# Altium schematic sheet PROCESSOR.SchDoc: Pin Swapping
size 558 x 431 mm; DocumentNumber: 2; SheetNumber: 2; SheetTotal: 6
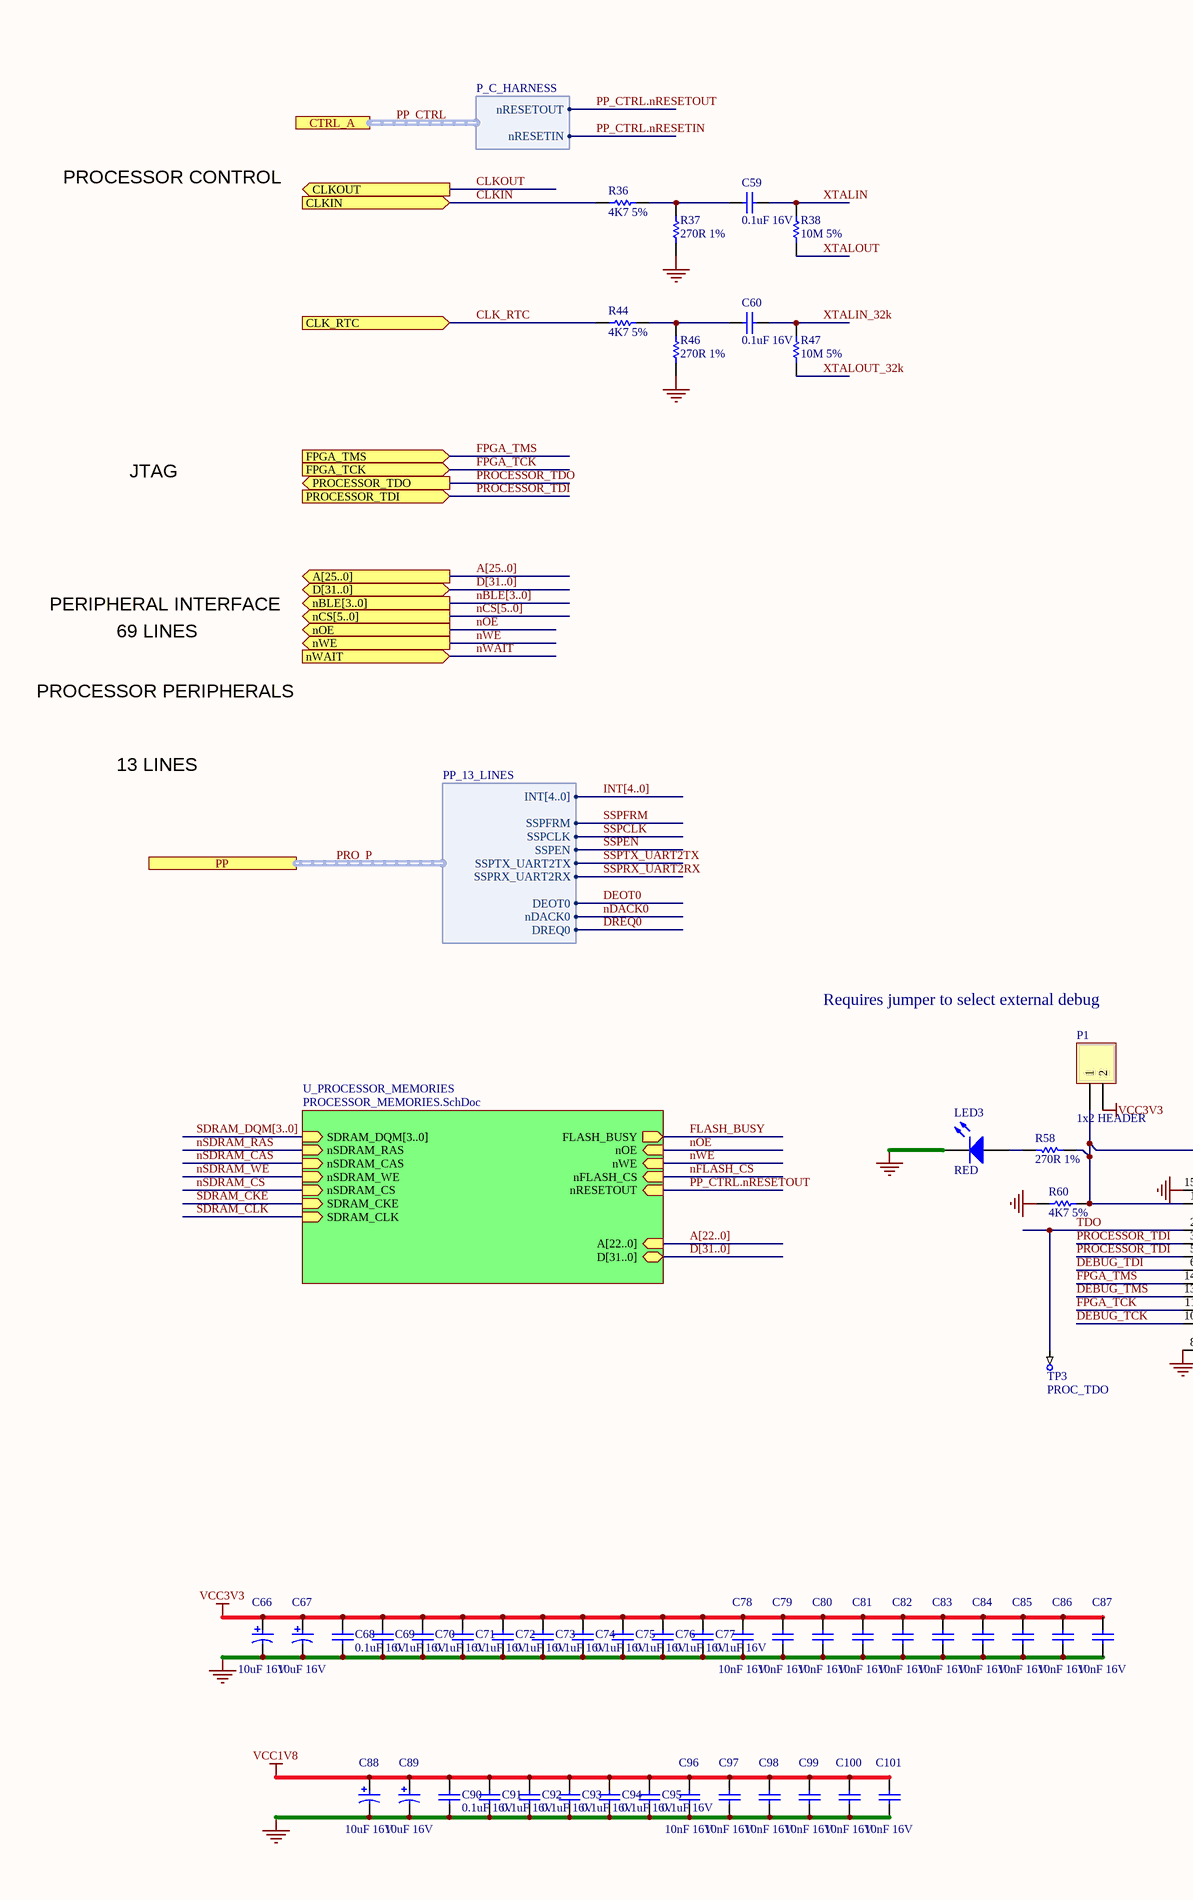
[diagram p0: PROCESSOR.SchDoc, left]
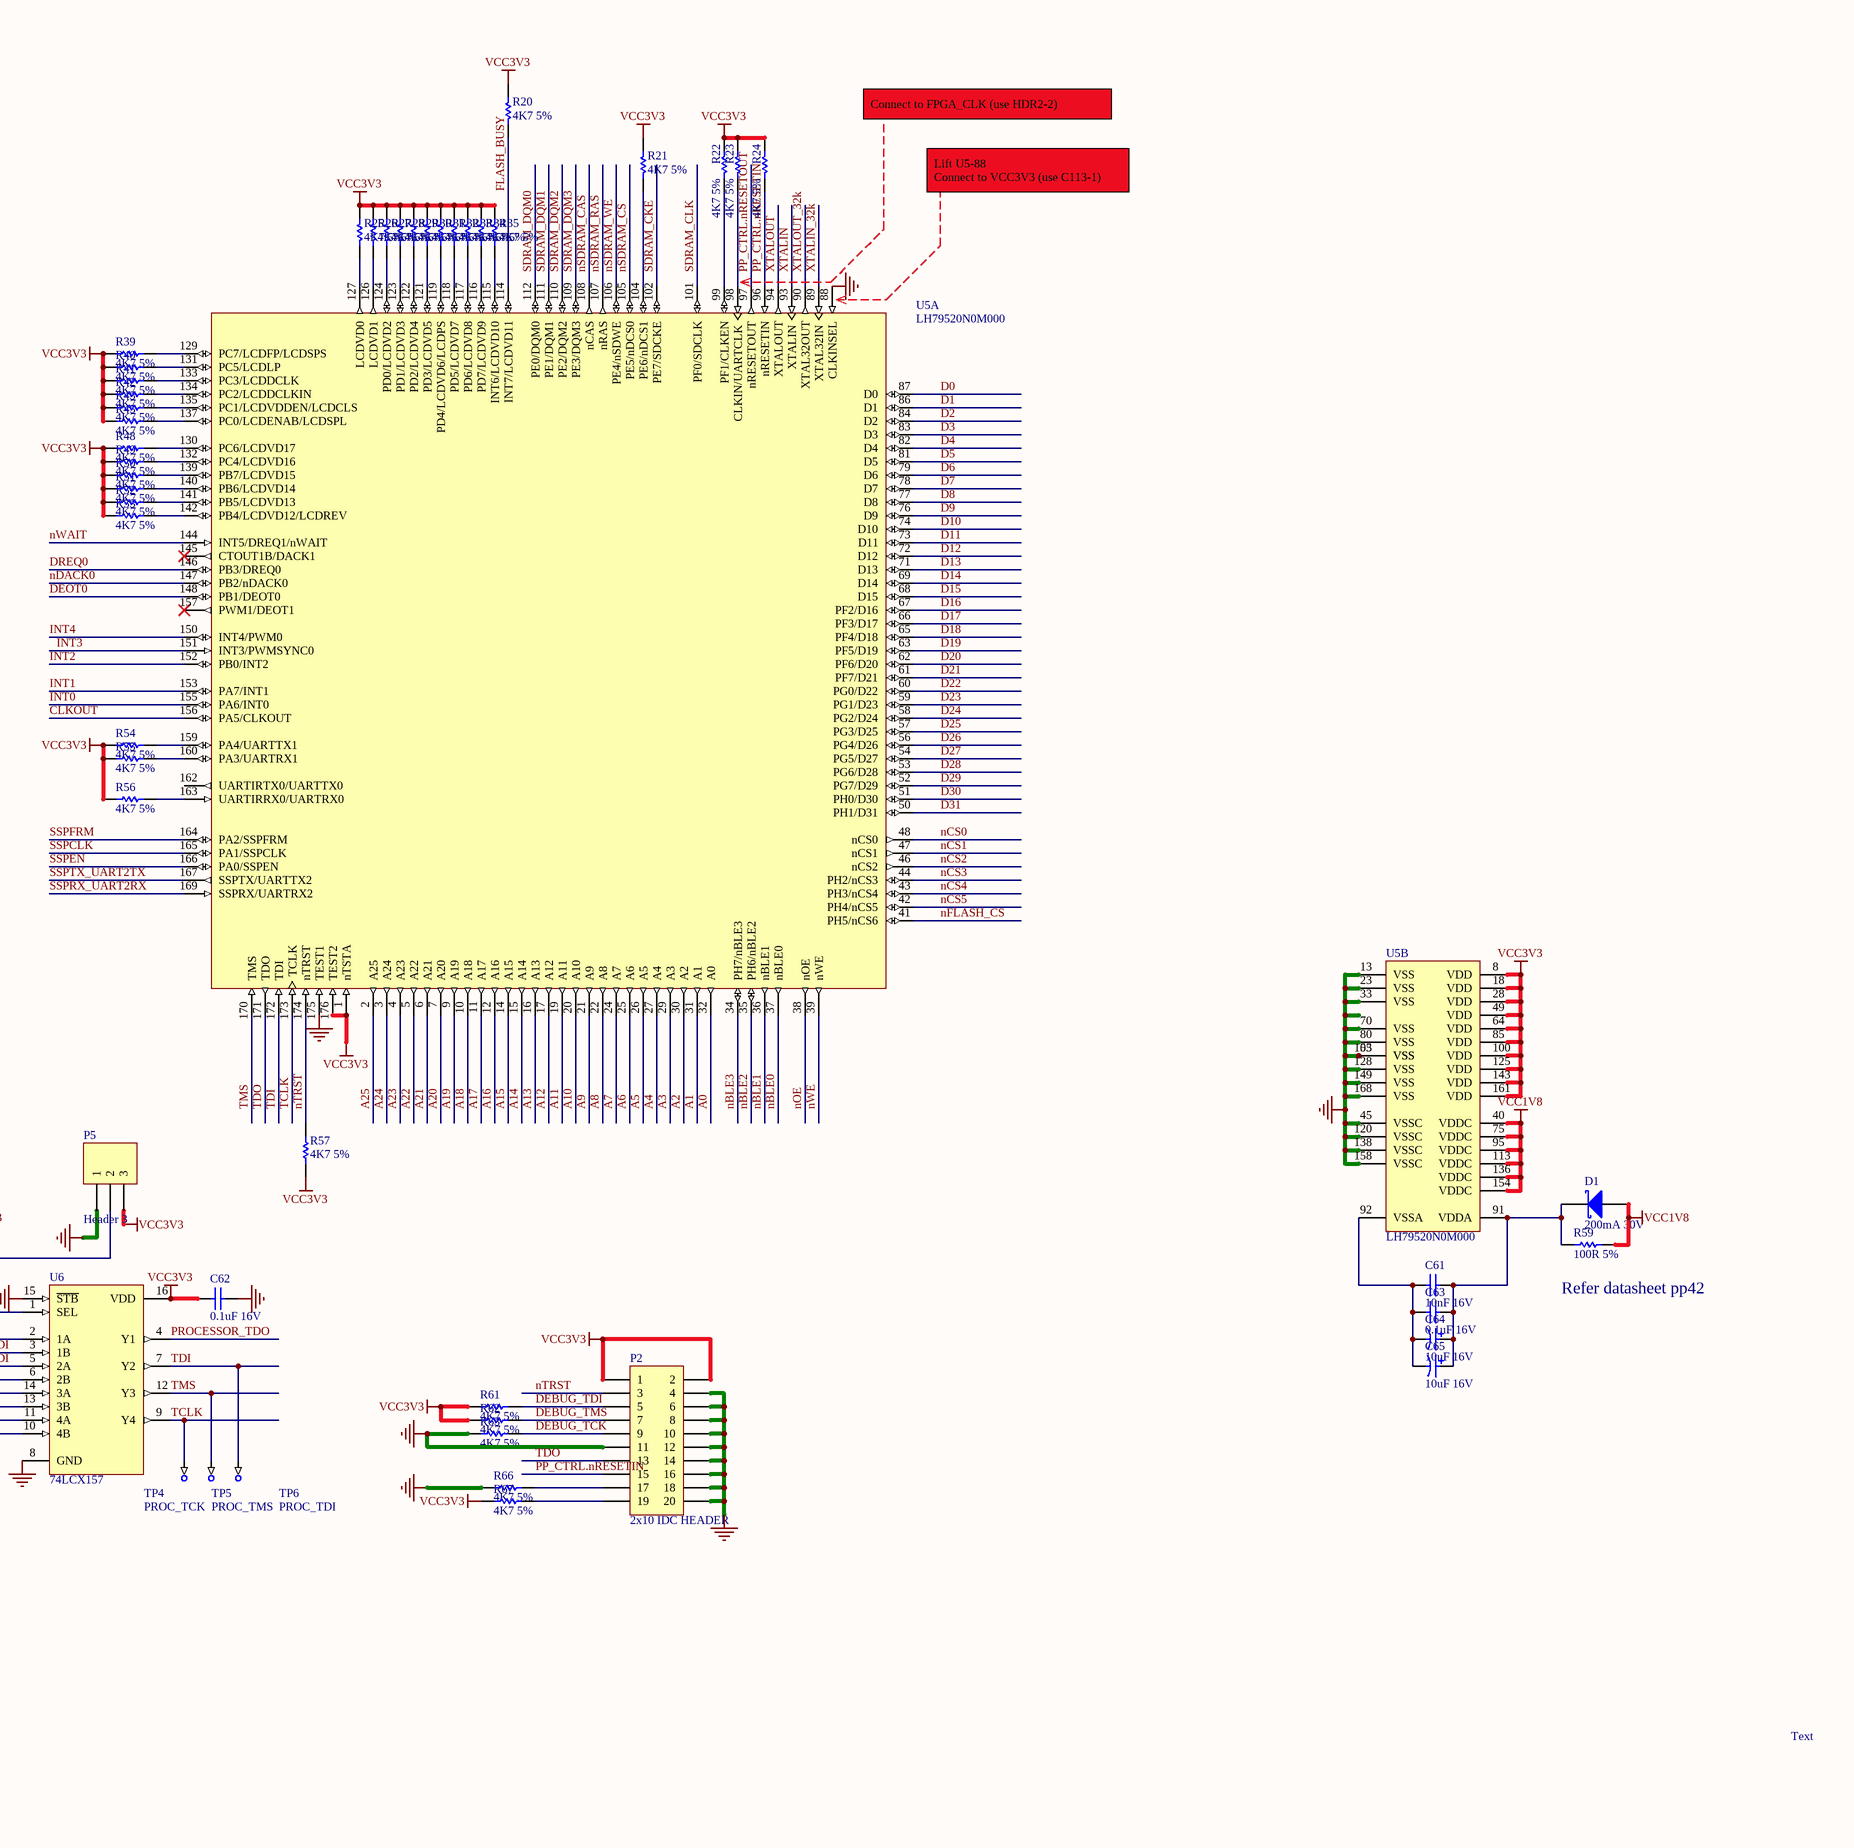
[diagram p1: PROCESSOR.SchDoc, right]

## Parts
C59  0.1uF 16V  [CAPC1005]
C60  0.1uF 16V  [CAPC1005]
C61  10nF 16V  [CAPC1005]
C62  0.1uF 16V  [CAPC1005]
C63  0.1uF 16V  [CAPC1005]
C64  10uF 16V  [CAPC3528]
C65  10uF 16V  [CAPC3528]
C66  10uF 16V  [CAPC3528]
C67  10uF 16V  [CAPC3528]
C68  0.1uF 16V  [CAPC1005]
C69  0.1uF 16V  [CAPC1005]
C70  0.1uF 16V  [CAPC1005]
C71  0.1uF 16V  [CAPC1005]
C72  0.1uF 16V  [CAPC1005]
C73  0.1uF 16V  [CAPC1005]
C74  0.1uF 16V  [CAPC1005]
C75  0.1uF 16V  [CAPC1005]
C76  0.1uF 16V  [CAPC1005]
C77  0.1uF 16V  [CAPC1005]
C78  10nF 16V  [CAPC1005]
C79  10nF 16V  [CAPC1005]
C80  10nF 16V  [CAPC1005]
C81  10nF 16V  [CAPC1005]
C82  10nF 16V  [CAPC1005]
C83  10nF 16V  [CAPC1005]
C84  10nF 16V  [CAPC1005]
C85  10nF 16V  [CAPC1005]
C86  10nF 16V  [CAPC1005]
C87  10nF 16V  [CAPC1005]
C88  10uF 16V  [CAPC3528]
C89  10uF 16V  [CAPC3528]
C90  0.1uF 16V  [CAPC1005]
C91  0.1uF 16V  [CAPC1005]
C92  0.1uF 16V  [CAPC1005]
C93  0.1uF 16V  [CAPC1005]
C94  0.1uF 16V  [CAPC1005]
C95  0.1uF 16V  [CAPC1005]
C96  10nF 16V  [CAPC1005]
C97  10nF 16V  [CAPC1005]
C98  10nF 16V  [CAPC1005]
C99  10nF 16V  [CAPC1005]
C100  10nF 16V  [CAPC1005]
C101  10nF 16V  [CAPC1005]
D1  200mA 30V  [SOT95P230-3]
LED3  RED  [LED2013]
P1  1x2 HEADER  [HDR1X2]
P2  2x10 IDC HEADER  [IDC2.54-V20D]
P5  Header 3  [HDR1X3]
R20  4K7 5%  [RESC1005]
R21  4K7 5%  [RESC1005]
R22  4K7 5%  [RESC1005]
R23  4K7 5%  [RESC1005]
R24  4K7 5%  [RESC1005]
R25  4K7 5%  [RESC1005]
R26  4K7 5%  [RESC1005]
R27  4K7 5%  [RESC1005]
R28  4K7 5%  [RESC1005]
R29  4K7 5%  [RESC1005]
R30  4K7 5%  [RESC1005]
R31  4K7 5%  [RESC1005]
R32  4K7 5%  [RESC1005]
R33  4K7 5%  [RESC1005]
R34  4K7 5%  [RESC1005]
R35  4K7 5%  [RESC1005]
R36  4K7 5%  [RESC1005]
R37  270R 1%  [RESC2012]
R38  10M 5%  [RESC2012]
R39  4K7 5%  [RESC1005]
R40  4K7 5%  [RESC1005]
R41  4K7 5%  [RESC1005]
R42  4K7 5%  [RESC1005]
R43  4K7 5%  [RESC1005]
R44  4K7 5%  [RESC1005]
R45  4K7 5%  [RESC1005]
R46  270R 1%  [RESC2012]
R47  10M 5%  [RESC2012]
R48  4K7 5%  [RESC1005]
R49  4K7 5%  [RESC1005]
R50  4K7 5%  [RESC1005]
R51  4K7 5%  [RESC1005]
R52  4K7 5%  [RESC1005]
R53  4K7 5%  [RESC1005]
R54  4K7 5%  [RESC1005]
R55  4K7 5%  [RESC1005]
R56  4K7 5%  [RESC1005]
R57  4K7 5%  [RESC1005]
R58  270R 1%  [RESC2012]
R59  100R 5%  [RESC2012]
R60  4K7 5%  [RESC1005]
R61  4K7 5%  [RESC1005]
R62  4K7 5%  [RESC1005]
R63  4K7 5%  [RESC1005]
R66  4K7 5%  [RESC1005]
R67  4K7 5%  [RESC1005]
TP3  PROC_TDO  [TestPin]  (no BOM)
TP4  PROC_TCK  [TestPin]  (no BOM)
TP5  PROC_TMS  [TestPin]  (no BOM)
TP6  PROC_TDI  [TestPin]  (no BOM)
U5  LH79520N0M000  [QFP40P2000X2000-176]  (parts A,B of 2)
U6  74LCX157  [TSOP65P638-16]

## Sub-sheets
U_PROCESSOR_MEMORIES = PROCESSOR_MEMORIES.SchDoc: SDRAM_DQM[3..0] (in), nSDRAM_RAS (in), nSDRAM_CAS (in), nSDRAM_WE (in), nSDRAM_CS (in), SDRAM_CKE (in), SDRAM_CLK (in), A[22..0] (in), D[31..0] (bidir), nOE (in), nWE (in), nFLASH_CS (in), nRESETOUT (in), FLASH_BUSY (out)

## Ports
A[25..0] (out), CLK_RTC (in), CLKIN (in), CLKOUT (out), CTRL_A (harness P_C_HARNESS), D[31..0] (bidir), FPGA_TCK (in), FPGA_TMS (in), nBLE[3..0] (out), nCS[5..0] (out), nOE (out), nWAIT (in), nWE (out), PP (harness PP_13_LINES), PROCESSOR_TDI (in), PROCESSOR_TDO (out)

## Harnesses
PP_13_LINES: INT[4..0], SSPFRM, SSPCLK, SSPEN, SSPTX_UART2TX, SSPRX_UART2RX, DEOT0, nDACK0, DREQ0
P_C_HARNESS: nRESETOUT, nRESETIN

## Nets
GND: C62.2 C66.2 C67.2 C68.2 C69.2 C70.2 C71.2 C72.2 C73.2 C74.2 C75.2 C76.2 C77.2 C78.2 C79.2 C80.2 C81.2 C82.2 C83.2 C84.2 C85.2 C86.2 C87.2 C88.2 C89.2 C90.2 C91.2 C92.2 C93.2 C94.2 C95.2 C96.2 C97.2 C98.2 C99.2 C100.2 C101.2 LED3.2(K) P2.4 P2.6 P2.8 P2.10 P2.11 P2.12 P2.14 P2.16 P2.18 P2.20 P5.1 R37.1 R46.1 R60.2 R63.1 R66.1 U5.13(VSS) U5.23(VSS) U5.33(VSS) U5.45(VSSC) U5.55(VSS) U5.70(VSS) U5.80(VSS) U5.88(CLKINSEL) U5.103(VSS) U5.120(VSSC) U5.128(VSS) U5.138(VSSC) U5.149(VSS) U5.158(VSSC) U5.168(VSS) U5.175(TEST1) U6.8(GND) U6.15(~{STB})
VCC1V8: C88.1 C89.1 C90.1 C91.1 C92.1 C93.1 C94.1 C95.1 C96.1 C97.1 C98.1 C99.1 C100.1 C101.1 D1.1(A) R59.1 U5.40(VDDC) U5.75(VDDC) U5.95(VDDC) U5.113(VDDC) U5.136(VDDC) U5.154(VDDC)
VCC3V3: C62.1 C66.1 C67.1 C68.1 C69.1 C70.1 C71.1 C72.1 C73.1 C74.1 C75.1 C76.1 C77.1 C78.1 C79.1 C80.1 C81.1 C82.1 C83.1 C84.1 C85.1 C86.1 C87.1 P1.2 P2.1 P2.2 P5.3 R20.2 R21.2 R22.2 R23.2 R24.2 R25.2 R26.2 R27.2 R28.2 R29.2 R30.2 R31.2 R32.2 R33.2 R34.2 R35.2 R39.2 R40.2 R41.2 R42.2 R43.2 R45.2 R48.2 R49.2 R50.2 R51.2 R52.2 R53.2 R54.2 R55.2 R56.2 R57.2 R61.1 R62.1 R67.1 U5.1(nTSTA) U5.8(VDD) U5.18(VDD) U5.28(VDD) U5.49(VDD) U5.64(VDD) U5.85(VDD) U5.100(VDD) U5.125(VDD) U5.143(VDD) U5.161(VDD) U5.176(TEST2) U6.16(VDD)
A0: U5.32(A0)
A1: U5.31(A1)
A2: U5.30(A2)
A3: U5.29(A3)
A4: U5.27(A4)
A5: U5.26(A5)
A6: U5.25(A6)
A7: U5.24(A7)
A8: U5.22(A8)
A9: U5.21(A9)
A10: U5.20(A10)
A11: U5.19(A11)
A12: U5.17(A12)
A13: U5.16(A13)
A14: U5.15(A14)
A15: U5.14(A15)
A16: U5.12(A16)
A17: U5.11(A17)
A18: U5.10(A18)
A19: U5.9(A19)
A20: U5.7(A20)
A21: U5.6(A21)
A22: U5.5(A22)
A23: U5.4(A23)
A24: U5.3(A24)
A25: U5.2(A25)
CLK_RTC: R44.2 ; port CLK_RTC
CLKIN: R36.2 ; port CLKIN
CLKOUT: U5.156(PA5/CLKOUT) ; port CLKOUT
D0: U5.87(D0)
D1: U5.86(D1)
D2: U5.84(D2)
D3: U5.83(D3)
D4: U5.82(D4)
D5: U5.81(D5)
D6: U5.79(D6)
D7: U5.78(D7)
D8: U5.77(D8)
D9: U5.76(D9)
D10: U5.74(D10)
D11: U5.73(D11)
D12: U5.72(D12)
D13: U5.71(D13)
D14: U5.69(D14)
D15: U5.68(D15)
D16: U5.67(PF2/D16)
D17: U5.66(PF3/D17)
D18: U5.65(PF4/D18)
D19: U5.63(PF5/D19)
D20: U5.62(PF6/D20)
D21: U5.61(PF7/D21)
D22: U5.60(PG0/D22)
D23: U5.59(PG1/D23)
D24: U5.58(PG2/D24)
D25: U5.57(PG3/D25)
D26: U5.56(PG4/D26)
D27: U5.54(PG5/D27)
D28: U5.53(PG6/D28)
D29: U5.52(PG7/D29)
D30: U5.51(PH0/D30)
D31: U5.50(PH1/D31)
DEBUG_TCK: P2.9 R63.2 U6.10(4B)
DEBUG_TDI: P2.5 R61.2 U6.6(2B)
DEBUG_TMS: P2.7 R62.2 U6.13(3B)
DEOT0: U5.148(PB1/DEOT0) ; port PP.DEOT0
DREQ0: U5.146(PB3/DREQ0) ; port PP.DREQ0
FLASH_BUSY: R20.1 U5.114(INT7/LCDVD11) ; sheet U_PROCESSOR_MEMORIES/FLASH_BUSY
FPGA_TCK: U6.11(4A) ; port FPGA_TCK
FPGA_TMS: U6.14(3A) ; port FPGA_TMS
INT0: U5.155(PA6/INT0)
INT1: U5.153(PA7/INT1)
INT2: U5.152(PB0/INT2)
INT3: U5.151(INT3/PWMSYNC0)
INT4: U5.150(INT4/PWM0)
nBLE0: U5.37(nBLE0)
nBLE1: U5.36(nBLE1)
nBLE2: U5.35(PH6/nBLE2)
nBLE3: U5.34(PH7/nBLE3)
nCS0: U5.48(nCS0)
nCS1: U5.47(nCS1)
nCS2: U5.46(nCS2)
nCS3: U5.44(PH2/nCS3)
nCS4: U5.43(PH3/nCS4)
nCS5: U5.42(PH4/nCS5)
nDACK0: U5.147(PB2/nDACK0) ; port PP.nDACK0
nFLASH_CS: U5.41(PH5/nCS6) ; sheet U_PROCESSOR_MEMORIES/nFLASH_CS
nOE: U5.38(nOE) ; port nOE, sheet U_PROCESSOR_MEMORIES/nOE
nSDRAM_CAS: U5.108(nCAS) ; sheet U_PROCESSOR_MEMORIES/nSDRAM_CAS
nSDRAM_CS: U5.105(PE5/nDCS0) ; sheet U_PROCESSOR_MEMORIES/nSDRAM_CS
nSDRAM_RAS: U5.107(nRAS) ; sheet U_PROCESSOR_MEMORIES/nSDRAM_RAS
nSDRAM_WE: U5.106(PE4/nSDWE) ; sheet U_PROCESSOR_MEMORIES/nSDRAM_WE
nTRST: P2.3 R57.1 U5.174(nTRST)
nWAIT: U5.144(INT5/DREQ1/nWAIT) ; port nWAIT
nWE: U5.39(nWE) ; port nWE, sheet U_PROCESSOR_MEMORIES/nWE
PP_CTRL.nRESETIN: P2.15 R24.1 U5.96(nRESETIN) ; port CTRL_A.nRESETIN
PP_CTRL.nRESETOUT: U5.97(nRESETOUT) ; sheet U_PROCESSOR_MEMORIES/nRESETOUT, port CTRL_A.nRESETOUT
PROCESSOR_TDI: U6.3(1B) U6.5(2A) ; port PROCESSOR_TDI
PROCESSOR_TDO: U6.4(Y1) ; port PROCESSOR_TDO
SDRAM_CKE: U5.102(PE7/SDCKE) ; sheet U_PROCESSOR_MEMORIES/SDRAM_CKE
SDRAM_CLK: U5.101(PF0/SDCLK) ; sheet U_PROCESSOR_MEMORIES/SDRAM_CLK
SDRAM_DQM0: U5.112(PE0/DQM0)
SDRAM_DQM1: U5.111(PE1/DQM1)
SDRAM_DQM2: U5.110(PE2/DQM2)
SDRAM_DQM3: U5.109(PE3/DQM3)
SSPCLK: U5.165(PA1/SSPCLK) ; port PP.SSPCLK  [project net PRO_P.SSPCLK]
SSPEN: U5.166(PA0/SSPEN) ; port PP.SSPEN  [project net PRO_P.SSPEN]
SSPFRM: U5.164(PA2/SSPFRM) ; port PP.SSPFRM  [project net PRO_P.SSPFRM]
SSPRX_UART2RX: U5.169(SSPRX/UARTRX2) ; port PP.SSPRX_UART2RX  [project net PRO_P.SSPRX_UART2RX]
SSPTX_UART2TX: U5.167(SSPTX/UARTTX2) ; port PP.SSPTX_UART2TX  [project net PRO_P.SSPTX_UART2TX]
TCLK: TP4.1 U5.173(TCLK) U6.9(Y4)
TDI: TP6.1 U5.172(TDI) U6.7(Y2)
TDO: P2.13 TP3.1 U5.171(TDO) U6.2(1A)
TMS: TP5.1 U5.170(TMS) U6.12(Y3)
XTALIN: C59.2 R38.1 U5.93(XTALIN)
XTALIN_32k: C60.2 R47.1 U5.89(XTAL32IN)
XTALOUT: R38.2 U5.94(XTALOUT)
XTALOUT_32k: R47.2 U5.90(XTAL32OUT)
NetC59_1: C59.1 R36.1 R37.2
NetC60_1: C60.1 R44.1 R46.2
NetC61_1: C61.1 C63.1 C64.1 C65.1 D1.3(k) R59.2 U5.91(VDDA)
NetC61_2: C61.2 C63.2 C64.2 C65.2 U5.92(VSSA)
NetLED3_1: LED3.1(A) R58.2
NetP1_1: P1.1 P5.2 R58.1 R60.1 U6.1(SEL)
NetP2_17: P2.17 R66.2
NetP2_19: P2.19 R67.2
NetR21_1: R21.1 U5.104(PE6/nDCS1)
NetR22_1: R22.1 U5.99(PF1/CLKEN)
NetR23_1: R23.1 U5.98(CLKIN/UARTCLK)
NetR25_1: R25.1 U5.127(LCDVD0)
NetR26_1: R26.1 U5.126(LCDVD1)
NetR27_1: R27.1 U5.124(PD0/LCDVD2)
NetR28_1: R28.1 U5.123(PD1/LCDVD3)
NetR29_1: R29.1 U5.122(PD2/LCDVD4)
NetR30_1: R30.1 U5.121(PD3/LCDVD5)
NetR31_1: R31.1 U5.119(PD4/LCDVD6/LCDPS)
NetR32_1: R32.1 U5.118(PD5/LCDVD7)
NetR33_1: R33.1 U5.117(PD6/LCDVD8)
NetR34_1: R34.1 U5.116(PD7/LCDVD9)
NetR35_1: R35.1 U5.115(INT6/LCDVD10)
NetR39_1: R39.1 U5.129(PC7/LCDFP/LCDSPS)
NetR40_1: R40.1 U5.131(PC5/LCDLP)
NetR41_1: R41.1 U5.133(PC3/LCDDCLK)
NetR42_1: R42.1 U5.134(PC2/LCDDCLKIN)
NetR43_1: R43.1 U5.135(PC1/LCDVDDEN/LCDCLS)
NetR45_1: R45.1 U5.137(PC0/LCDENAB/LCDSPL)
NetR48_1: R48.1 U5.130(PC6/LCDVD17)
NetR49_1: R49.1 U5.132(PC4/LCDVD16)
NetR50_1: R50.1 U5.139(PB7/LCDVD15)
NetR51_1: R51.1 U5.140(PB6/LCDVD14)
NetR52_1: R52.1 U5.141(PB5/LCDVD13)
NetR53_1: R53.1 U5.142(PB4/LCDVD12/LCDREV)
NetR54_1: R54.1 U5.159(PA4/UARTTX1)
NetR55_1: R55.1 U5.160(PA3/UARTRX1)
NetR56_1: R56.1 U5.163(UARTIRRX0/UARTRX0)

Not connected (* = marked no-connect by the designer): D1 2; U5 145(CTOUT1B/DACK1)* 157(PWM1/DEOT1)* 162(UARTIRTX0/UARTTX0)

## Buses and harness runs
bus A[22..0] = sheet U_PROCESSOR_MEMORIES/A[22..0]
bus A[25..0] = port A[25..0]
bus D[31..0] = port D[31..0]
bus D[31..0] = sheet U_PROCESSOR_MEMORIES/D[31..0]
bus INT[4..0]
bus nBLE[3..0] = port nBLE[3..0]
bus nCS[5..0] = port nCS[5..0]
bus SDRAM_DQM[3..0] = sheet U_PROCESSOR_MEMORIES/SDRAM_DQM[3..0]
harness PP_CTRL = port CTRL_A
harness PRO_P = port PP

## Notes on the sheet
- Connect to FPGA_CLK (use HDR2-2)
- Lift U5-88
  Connect to VCC3V3 (use C113-1)
- PROCESSOR CONTROL
- JTAG
- PERIPHERAL INTERFACE
- 69 LINES
- PROCESSOR PERIPHERALS
- 13 LINES
- Requires jumper to select external debug
- (near R59) Refer datasheet pp42
- Text
- 10
- 9
- 8
- 7
- 6
- 5
- 4
- 3
- DWG. NO.
- 2
- 1
- REV.
- SHT.
- REVISION
- DESCRIPTION
- DATE
- APPROVED
- H
- THIS DOCUMENT AND THE DATA DISCLOSED HEREIN OR HEREWITH IS THE PROPERTY OF ALTIUM LIMITED AND MAY BE FREELY DISTRIBUTED IN WHOLE. NO RIGHTS ARE RESERVED OR EXPRESS OR IMPLIED WARANTEE GIVEN.
- G
- F
- E
- D
- C
- B
- A
- TITLE
- SCALE:
- SIZE
- CAGE CODE
- FILE NAME
- DWG NO.
- SHEET
- OF
- REV

## Library data of the parts
C59-C63 C68-C87 C90-C101 = CAP-NP: Capacitor
  C59 C60 C62 C63 C68-C77 C90-C95: Design Item Id: CAP-NP-0.1uF-16V-0402
  C61 C78-C87 C96-C101: Design Item Id: CAP-NP-10nF-16V-0402
C64-C67 C88 C89 = CAP-P: Polar Capacitor; Design Item Id: CAP-P-10uF-16V-MCCT-B
D1 = DIO-SCHOTTKY-1S-SOT23: Schottky Barrier Double Diode; Design Item Id: DIO-SCHOTTKY-1S-SOT23
LED3 = DIO-LED-1S: Typical GREEN SMD LED Agilent make; Design Item Id: LED-RED-HSMHC170
P1 = CON-HDR-1x2-STR: Header, 2-Pin; Design Item Id: CON-HDRSTR-2x1-2.54mm
P2 = CON-IDC-2x10-M-STR: 10x2 IDC Male PCB Box Header; Design Item Id: CON-IDCHDRSTRBOX-M-20
P5 = Header 3: Header, 3-Pin; LatestRevisionDate: 17-Jul-2002; LatestRevisionNote: Re-released for DXP Platform.; Publisher: Altium Limited
R20-R63 R66 R67 = RES: Resistor
  R20-R36 R39-R45 R48-R57 R60-R63 R66 R67: Design Item Id: RES-4K7-0402
  R37 R46 R58: Design Item Id: RES-270R-1%-0805
  R38 R47: Design Item Id: RES-10M-0805
  R59: Design Item Id: RES-100R-0805
TP3-TP6 = TestPin: Design Item Id: TestPin
U5 = LH79520N0M000: 32-Bit ARM720T-Based BlueStreak MCU with 8KB Cache, MMU, Color LCD controller, 32KB SRAM, 176-Pin LQFP; Design Item Id: LH79520N0M000
U6 = 74LCX157-TSOP16: Quad 2-Input Multiplexer; Design Item Id: 74LCX157-TSOP16